# Altium schematic sheet ife19_Elec_TS_BrakePedal.SchDoc
size A
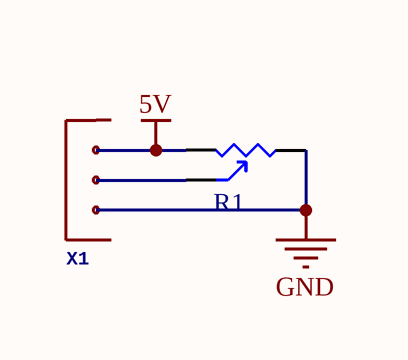
[diagram p0: ife19_Elec_TS_BrakePedal.SchDoc]

## Parts
R1  POT_BEI9605  [POT_BEI9605]  (value not drawn)
X1  Molex 505575-03 3 Position 2.00mm pitch connector wire to board connector Datasheet  [505578-03]  (value not drawn)

## Nets
5V: R1.1 X1.3
GND: R1.3 X1.1
NetR1_2: R1.2 X1.2

## Library data of the parts
X1 = POS3_ML505578-03: GateName_1: G$1; SymbolName_1: 3POS; LibraryName: MOLEX Micro-Lock; DeviceSetName: 505575-03; Package: 505575-03